# Altium schematic sheet WiFi.SchDoc
size A; PageSetup: Record=PageOptions|CenterHorizontal=True|CenterVertical=True|PrintScale=1.00|XCorrection=1.00|YCorrection=1.00|PrintKind=1|BorderSize=5000000|LeftOffset=0|BottomOffset=0|Orientation=2|PaperLength=1000|PaperWidth=1000|Scale=100|PaperSource=7|PrintQuality=-3|MediaType=1|DitherType=10|PrintScaleMode=1|PaperKind=Letter|PaperIndex=1
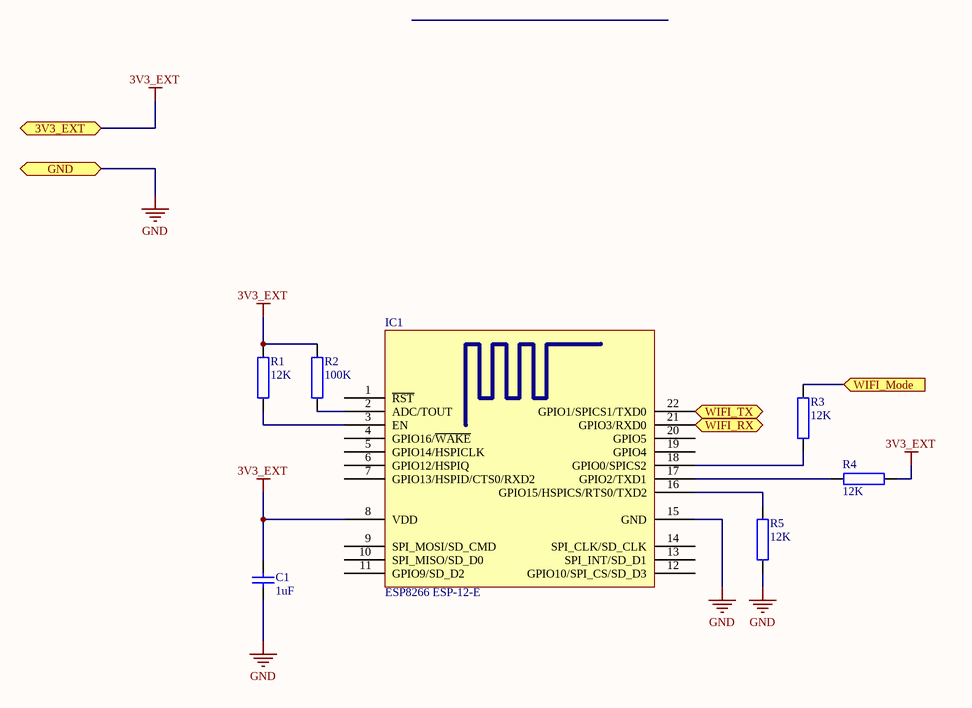
[diagram p0: WiFi.SchDoc]

## Parts
C1  1uF  [C0603]
IC1  ESP8266 ESP-12-E  [ESP_12_E]
R1  12K  [R0603]
R2  100K  [R0603]
R3  12K  [R0603]
R4  12K  [R0603]
R5  12K  [R0603]

## Ports
3V3_EXT, GND, WIFI_Mode (in), WIFI_RX (in), WIFI_TX (out)

## Nets
3V3_EXT: C1.2 IC1.8(VDD) R1.2 R2.2 R4.1 ; port 3V3_EXT
GND: C1.1 IC1.15(GND) R5.2 ; port GND
WIFI_Mode: R3.1 ; port WIFI_Mode
WIFI_RX: IC1.21(GPIO3/RXD0) ; port WIFI_RX
WIFI_TX: IC1.22(GPIO1/SPICS1/TXD0) ; port WIFI_TX
NetIC1_2: IC1.2(ADC/TOUT) R2.1
NetIC1_3: IC1.3(EN) R1.1
NetIC1_16: IC1.16(GPIO15/HSPICS/RTS0/TXD2) R5.1
NetIC1_17: IC1.17(GPIO2/TXD1) R4.2
NetIC1_18: IC1.18(GPIO0/SPICS2) R3.2

Not connected (* = marked no-connect by the designer): IC1 1(~{RST}) 4(GPIO16/~{WAKE}) 5(GPIO14/HSPICLK) 6(GPIO12/HSPIQ) 7(GPIO13/HSPID/CTS0/RXD2) 9(SPI_MOSI/SD_CMD) 10(SPI_MISO/SD_D0) 11(GPIO9/SD_D2) 12(GPIO10/SPI_CS/SD_D3) 13(SPI_INT/SD_D1) 14(SPI_CLK/SD_CLK) 19(GPIO4) 20(GPIO5)

## Library data of the parts
C1 = Cap: Capacitor (Semiconductor SIM Model); Published: 8-Jun-2000; LatestRevisionDate: 29-May-2009; LatestRevisionNote: IPC-7351 Footprint Added.; PackageReference: C0603; Publisher: Altium Limited; PackageDescription: Chip Capacitor; Value: 1uF
R1-R5 = Res3: Resistor; Published: 8-Jun-2000; LatestRevisionDate: 29-May-2009; LatestRevisionNote: IPC-7351 Footprint Added.; PackageReference: R0603; Publisher: Altium Limited; PackageDescription: Chip Resistor
  R1 R3-R5: Value: 12K
  R2: Value: 100K